# EAGLE schematic Load_cell_cable (EAGLE 4.13)
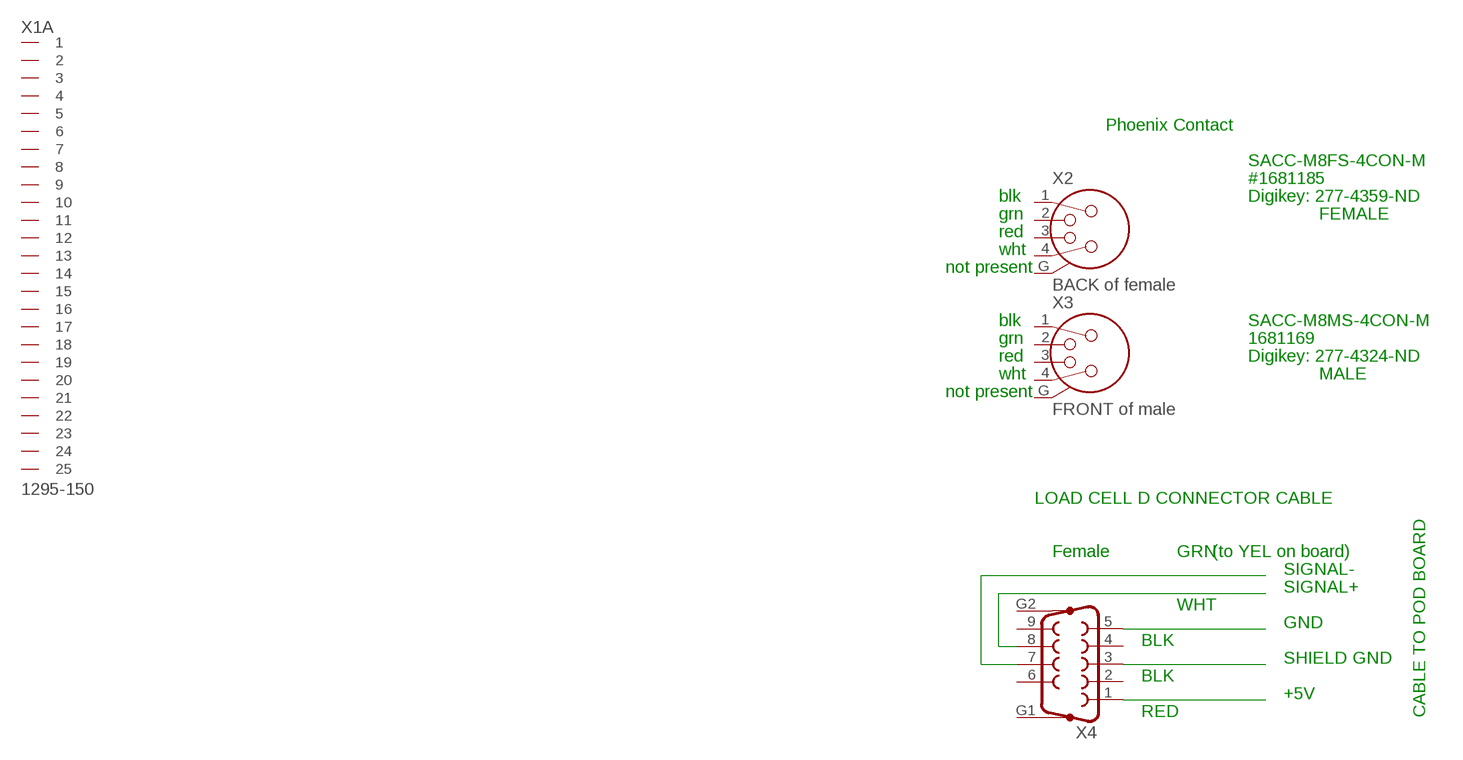
[diagram p0: schematic, sheet 1]

## Parts
X1  1295-150  [1295-150]
X2  BACK of female  NC4MAV  [NC4MAV]
X3  FRONT of male  NC4MAV  [NC4MAV]
X4  F09VP  [F09VP]

## Nets
N$1: X4.1
N$2: X4.3
N$3: X4.5
N$4: X4.8
N$5: X4.7
Unconnected: X1.A1 X1.A2 X1.A3 X1.A4 X1.A5 X1.A6 X1.A7 X1.A8 X1.A9 X1.A10 X1.A11 X1.A12 X1.A13 X1.A14 X1.A15 X1.A16 X1.A17 X1.A18 X1.A19 X1.A20 X1.A21 X1.A22 X1.A23 X1.A24 X1.A25 X1.B1 X1.B2 X1.B3 X1.B4 X1.B5 X1.B6 X1.B7 X1.B8 X1.B9 X1.B10 X1.B11 X1.B12 X1.B13 X1.B14 X1.B15 X1.B16 X1.B17 X1.B18 X1.B19 X1.B20 X1.B21 X1.B22 X1.B23 X1.B24 X1.B25 X1.C1 X1.C2 X1.C3 X1.C4 X1.C5 X1.C6 X1.C7 X1.C8 X1.C9 X1.C10 X1.C11 X1.C12 X1.C13 X1.C14 X1.C15 X1.C16 X1.C17 X1.C18 X1.C19 X1.C20 X1.C21 X1.C22 X1.C23 X1.C24 X1.C25 X1.D1 X1.D2 X1.D3 X1.D4 X1.D5 X1.D6 X1.D7 X1.D8 X1.D9 X1.D10 X1.D11 X1.D12 X1.D13 X1.D14 X1.D15 X1.D16 X1.D17 X1.D18 X1.D19 X1.D20 X1.D21 X1.D22 X1.D23 X1.D24 X1.D25 X1.E1 X1.E2 X1.E3 X1.E4 X1.E5 X1.E6 X1.E7 X1.E8 X1.E9 X1.E10 X1.E11 X1.E12 X1.E13 X1.E14 X1.E15 X1.E16 X1.E17 X1.E18 X1.E19 X1.E20 X1.E21 X1.E22 X1.E23 X1.E24 X1.E25 X1.F1 X1.F2 X1.F3 X1.F4 X1.F5 X1.F6 X1.F7 X1.F8 X1.F9 X1.F10 X1.F11 X1.F12 X1.F13 X1.F14 X1.F15 X1.F16 X1.F17 X1.F18 X1.F19 X1.F20 X1.F21 X1.F22 X1.F23 X1.F24 X1.F25 X2.1 X2.2 X2.3 X2.4 X2.G X3.1 X3.2 X3.3 X3.4 X3.G X4.2 X4.4 X4.6 X4.9 X4.G1 X4.G2

## Notes on the sheet
- Phoenix Contact
- SACC-M8FS-4CON-M
- #1681185
- blk | Digikey: 277-4359-ND
- grn | FEMALE
- red
- wht
- not present
- blk | SACC-M8MS-4CON-M
- grn | 1681169
- red | Digikey: 277-4324-ND
- wht | MALE
- not present
- LOAD CELL D CONNECTOR CABLE
- Female | GRN | (to YEL on board)
- SIGNAL-
- SIGNAL+
- WHT
- GND
- BLK
- SHIELD GND
- BLK
- +5V
- RED | CABLE TO POD BOARD

## Library data of the parts
X1 = con-commcon:1295-150: .800" BOARD SPACE 2mm CONNECTORS - HI TEMP 6 ROW 2mm- END OF STACK HEADER
X2 X3 = con-neutrik_ag:NC4: Neutrik Audio Connector XLR SERIES Stereo 1/4" jack Source: www.neutrik.com/
X4 = con-subd:F09VP: SUB-D

## Net classes
0 default: width 0.406 mm, clearance 0.711 mm